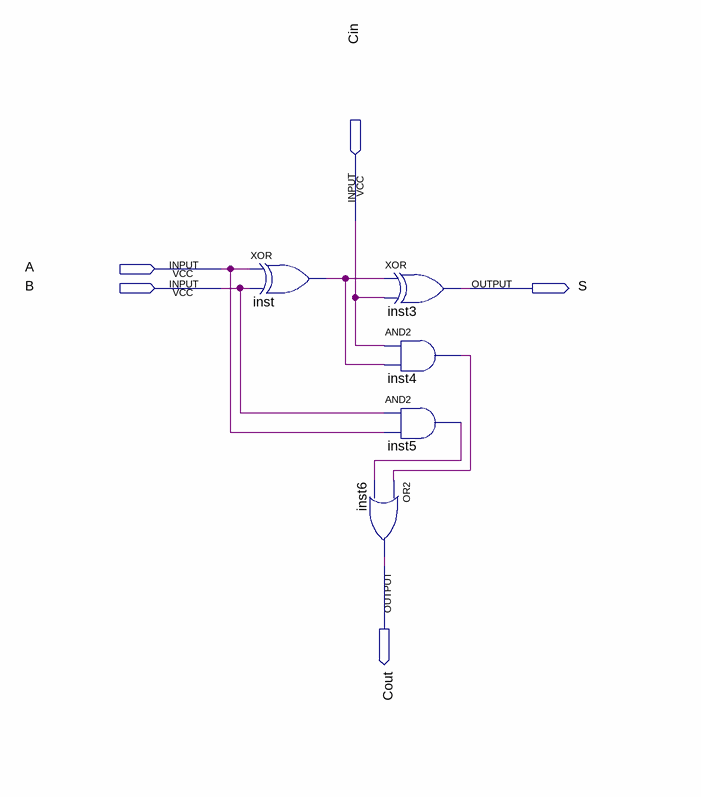
[diagram p0: schematic sheet]
// Quartus schematic fulladder.bdf as structural Verilog: 5 symbols, 5 pins
module fulladder (
  input  Cin,
  input  A,
  input  B,
  output S,
  output Cout
);

  wire inst4_out, inst5_out, inst_out;

  xor inst (inst_out, A, B);
  or inst6 (Cout, inst4_out, inst5_out);
  xor inst3 (S, inst_out, Cin);
  and inst4 (inst4_out, Cin, inst_out);
  and inst5 (inst5_out, B, A);
endmodule
